# Altium schematic sheet roll_paper_output.SchDoc
size A3
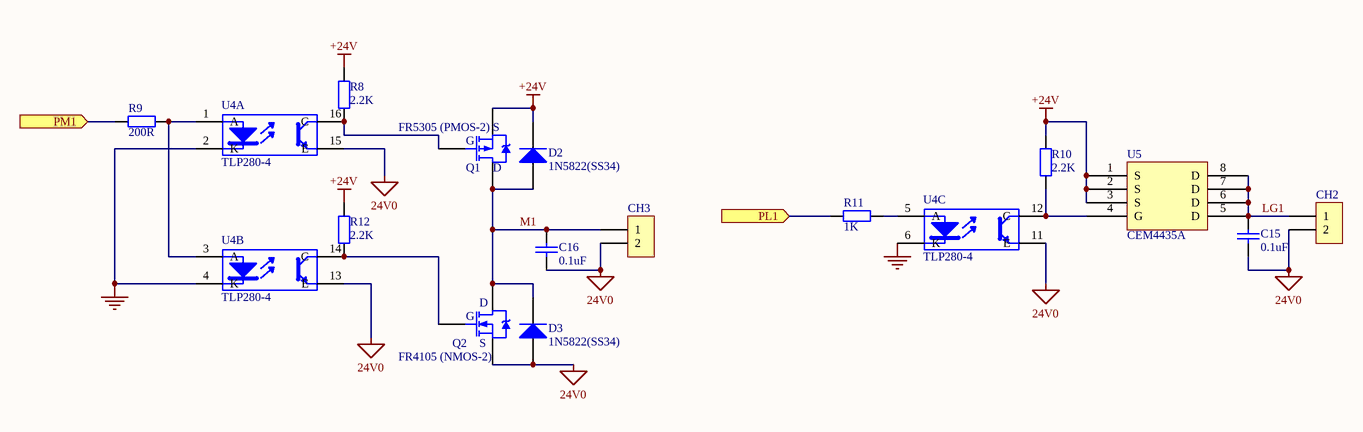
[diagram p0: roll_paper_output.SchDoc]

## Parts
C15  value 0.1uF  [0805]  (hidden comment: Cap)
C16  value 0.1uF  [0805]  (hidden comment: Cap)
CH2  HEADER1X2  [CH3.96-2PIN]  (value not drawn)
CH3  HEADER1X2  [CH3.96-2PIN]  (value not drawn)
D2  1N5822(SS34)  [SMA]
D3  1N5822(SS34)  [SMA]
Q1  FR5305 (PMOS-2)  [TO-252]
Q2  FR4105 (NMOS-2)  [TO-252]
R8  value 2.2K  [0805]  (hidden comment: Res2)
R9  value 200R  [0805]  (hidden comment: Res2)
R10  value 2.2K  [0805]  (hidden comment: Res2)
R11  value 1K  [0805]  (hidden comment: Res2)
R12  value 2.2K  [0805]  (hidden comment: Res2)
U4  TLP280-4  [SO16]  (parts A,B,C of 4)
U5  CEM4435A  [SOP8-OP27]

## Ports
PL1 (in), PM1 (in)

## Nets
24V0: C15.2 C16.2 CH2.2 CH3.2 D3.1(A) Q2.3(S) U4.11(E) U4.13(E) U4.15(E)
+24V: D2.2(K) Q1.3(S) R8.2 R10.2 R12.2 U5.1(S) U5.2(S) U5.3(S)
GND: U4.2(K) U4.4(K) U4.6(K)
LG1: C15.1 CH2.1 U5.5(D) U5.6(D) U5.7(D) U5.8(D)
M1: C16.1 CH3.1 D2.1(A) D3.2(K) Q1.2(D) Q2.2(D)
PL1: R11.1 ; port PL1
PM1: R9.1 ; port PM1
NetQ1_1: Q1.1(G) R8.1 U4.16(C)
NetQ2_1: Q2.1(G) R12.1 U4.14(C)
NetR9_2: R9.2 U4.1(A) U4.3(A)
NetR10_1: R10.1 U4.12(C) U5.4(G)
NetR11_2: R11.2 U4.5(A)

## Notes on the sheet
- (near Q1) S
- (near Q1) G
- (near Q1) D
- (near Q2) G
- (near Q2) D
- (near Q2) S

## Library data of the parts
C15 C16 = Cap: Capacitor; Published: 8-Jun-2000; LatestRevisionDate: 17-Jul-2002; LatestRevisionNote: Re-released for DXP Platform.; PackageReference: RAD-0.3; Publisher: Altium Limited
D2 D3 = Diode 1N4148: High Conductance Fast Diode; Published: 8-Jun-2000; LatestRevisionDate: 17-Jul-2002; LatestRevisionNote: Re-released for DXP Platform.; DatasheetDocument: 1997; PackageReference: DO-35; Publisher: Altium Limited; Code_JEDEC: DO-204-AH; ComponentLink1Description: Manufacturer Link; ComponentLink1URL: http://www.fairchildsemi.com/; ComponentLink2Description: Datasheet; ComponentLink2URL: http://www.fairchildsemi.com/ds/1N%2F1N4148.pdf
Q1 = PMOS-2: P-Channel Power MOSFET; Note: Pin 4 not drawn and electrically connected to Pin 2.; Published: 8-Jun-2000; LatestRevisionDate: 17-Jul-2002; LatestRevisionNote: Re-released for DXP Platform.; DatasheetDocument: PD-9.390D; PackageReference: TO-220AB; Publisher: Altium Limited; Code_JEDEC: TO-220-AB; ComponentLink1Description: Manufacturer Link; ComponentLink1URL: http://www.irf.com/
Q2 = NMOS-2: N-Channel Power MOSFET; Note: Pin 2 is electrically connected to pin 4.; Published: 8-Jun-2000; LatestRevisionDate: 17-Jul-2002; LatestRevisionNote: Re-released for DXP Platform.; DatasheetDocument: PD-9.814; PackageReference: TO-220AB; Publisher: Altium Limited; Code_JEDEC: TO-220-AB; ComponentLink1Description: Manufacturer Link; ComponentLink1URL: http://www.irf.com/
R8-R12 = Res2: Resistor; Published: 8-Jun-2000; LatestRevisionDate: 17-Jul-2002; LatestRevisionNote: Re-released for DXP Platform.; PackageReference: AXIAL-0.4; Publisher: Altium Limited
U4 = TLP521-4